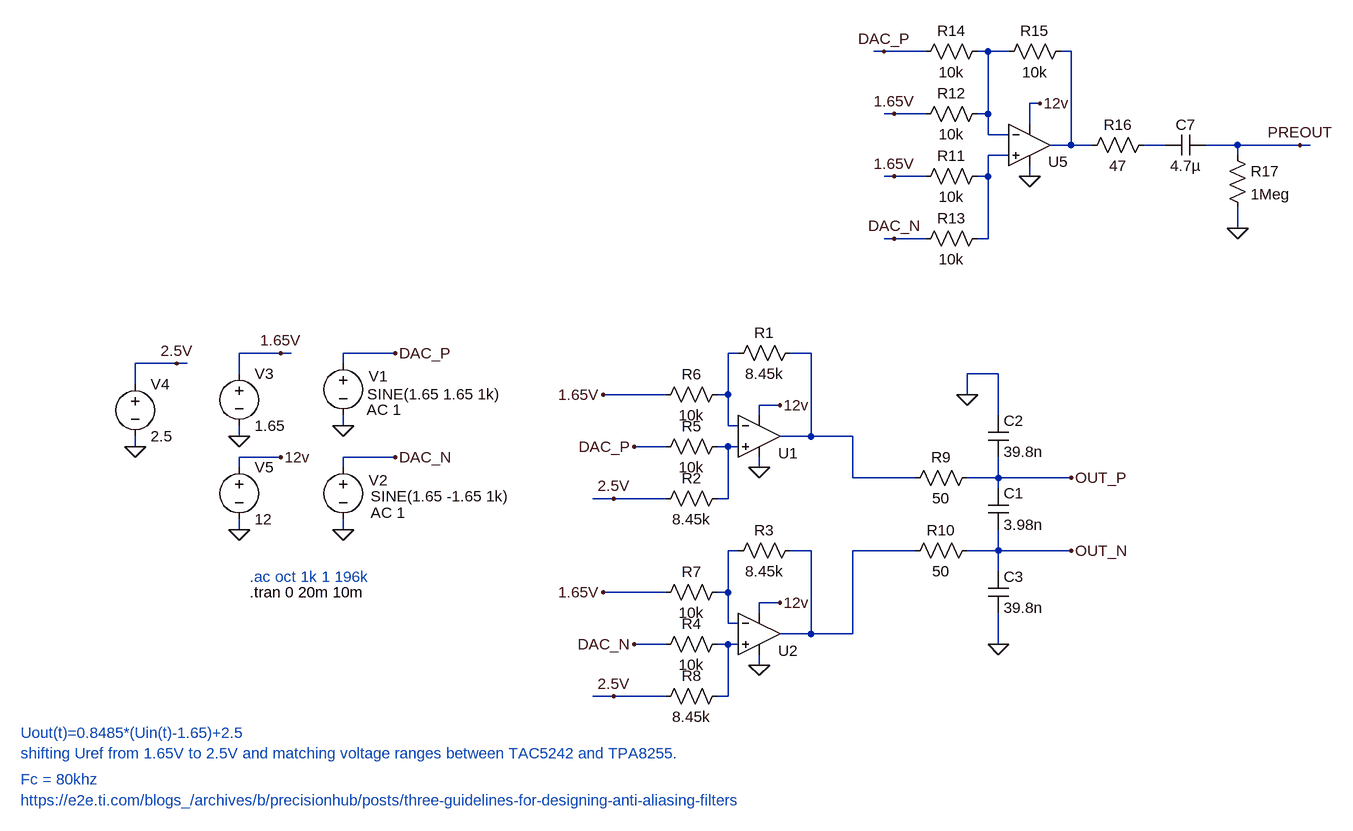
[diagram p0: schematic dac_frontend.asc]
dac_frontend.asc, the LTspice schematic file:
Version 4
SHEET 1 4008 788
WIRE 1824 -1072 1808 -1072
WIRE 1888 -1072 1824 -1072
WIRE 1984 -1072 1968 -1072
WIRE 2016 -1072 1984 -1072
WIRE 2112 -1072 2096 -1072
WIRE 2064 -992 2048 -992
WIRE 1840 -976 1824 -976
WIRE 1888 -976 1840 -976
WIRE 1984 -976 1984 -1072
WIRE 1984 -976 1968 -976
WIRE 2048 -960 2048 -992
WIRE 1984 -944 1984 -976
WIRE 2016 -944 1984 -944
WIRE 2112 -928 2112 -1072
WIRE 2112 -928 2080 -928
WIRE 2144 -928 2112 -928
WIRE 2256 -928 2224 -928
WIRE 2368 -928 2320 -928
WIRE 2464 -928 2368 -928
WIRE 2480 -928 2464 -928
WIRE 2016 -912 1984 -912
WIRE 2368 -912 2368 -928
WIRE 1840 -880 1824 -880
WIRE 1888 -880 1840 -880
WIRE 1984 -880 1984 -912
WIRE 1984 -880 1968 -880
WIRE 2048 -880 2048 -896
WIRE 2368 -800 2368 -832
WIRE 1840 -784 1824 -784
WIRE 1888 -784 1840 -784
WIRE 1984 -784 1984 -880
WIRE 1984 -784 1968 -784
WIRE 896 -608 832 -608
WIRE 912 -608 896 -608
WIRE 1072 -608 992 -608
WIRE 1600 -608 1584 -608
WIRE 1712 -608 1680 -608
WIRE 736 -592 672 -592
WIRE 752 -592 736 -592
WIRE 992 -592 992 -608
WIRE 832 -576 832 -608
WIRE 2000 -576 1952 -576
WIRE 672 -560 672 -592
WIRE 1488 -544 1392 -544
WIRE 1584 -544 1584 -608
WIRE 1584 -544 1568 -544
WIRE 1952 -544 1952 -576
WIRE 1664 -528 1632 -528
WIRE 1632 -512 1632 -528
WIRE 2000 -512 2000 -576
WIRE 992 -496 992 -512
WIRE 1584 -496 1584 -544
WIRE 1600 -496 1584 -496
WIRE 832 -480 832 -496
WIRE 1712 -480 1712 -608
WIRE 1712 -480 1664 -480
WIRE 1776 -480 1712 -480
WIRE 672 -464 672 -480
WIRE 1488 -464 1440 -464
WIRE 1584 -464 1568 -464
WIRE 1600 -464 1584 -464
WIRE 896 -448 832 -448
WIRE 1072 -448 992 -448
WIRE 832 -432 832 -448
WIRE 992 -432 992 -448
WIRE 1632 -432 1632 -448
WIRE 1776 -416 1776 -480
WIRE 1872 -416 1776 -416
WIRE 2000 -416 2000 -448
WIRE 2000 -416 1952 -416
WIRE 2112 -416 2000 -416
WIRE 2000 -400 2000 -416
WIRE 1408 -384 1376 -384
WIRE 1488 -384 1408 -384
WIRE 1584 -384 1584 -464
WIRE 1584 -384 1568 -384
WIRE 832 -336 832 -352
WIRE 992 -336 992 -352
WIRE 1600 -304 1584 -304
WIRE 1712 -304 1680 -304
WIRE 1872 -304 1776 -304
WIRE 2000 -304 2000 -336
WIRE 2000 -304 1952 -304
WIRE 2112 -304 2000 -304
WIRE 2000 -272 2000 -304
WIRE 1488 -240 1392 -240
WIRE 1584 -240 1584 -304
WIRE 1584 -240 1568 -240
WIRE 1664 -224 1632 -224
WIRE 1632 -208 1632 -224
WIRE 1584 -192 1584 -240
WIRE 1600 -192 1584 -192
WIRE 1712 -176 1712 -304
WIRE 1712 -176 1664 -176
WIRE 1776 -176 1776 -304
WIRE 1776 -176 1712 -176
WIRE 1488 -160 1440 -160
WIRE 1584 -160 1568 -160
WIRE 1600 -160 1584 -160
WIRE 2000 -160 2000 -208
WIRE 1632 -128 1632 -144
WIRE 1408 -80 1376 -80
WIRE 1488 -80 1408 -80
WIRE 1584 -80 1584 -160
WIRE 1584 -80 1568 -80
FLAG 1072 -608 DAC_P
FLAG 992 -496 0
FLAG 1072 -448 DAC_N
FLAG 992 -336 0
FLAG 832 -336 0
FLAG 896 -448 12v
FLAG 1664 -528 12v
FLAG 1632 -432 0
FLAG 1440 -464 DAC_P
FLAG 2048 -880 0
FLAG 1824 -1072 DAC_P
FLAG 1840 -784 DAC_N
FLAG 2064 -992 12v
FLAG 832 -480 0
FLAG 896 -608 1.65V
FLAG 1840 -976 1.65V
FLAG 1840 -880 1.65V
FLAG 2464 -928 PREOUT
FLAG 2368 -800 0
FLAG 672 -464 0
FLAG 736 -592 2.5V
FLAG 1392 -544 1.65V
FLAG 1408 -384 2.5V
FLAG 1664 -224 12v
FLAG 1632 -128 0
FLAG 1440 -160 DAC_N
FLAG 1392 -240 1.65V
FLAG 1408 -80 2.5V
FLAG 1952 -544 0
FLAG 2000 -160 0
FLAG 2112 -416 OUT_P
FLAG 2112 -304 OUT_N
SYMBOL voltage 992 -608 R0
WINDOW 0 39 36 Left 2
WINDOW 3 37 63 Left 2
WINDOW 123 36 87 Left 2
WINDOW 39 40 76 Left 2
SYMATTR InstName V1
SYMATTR Value SINE(1.65 1.65 1k)
SYMATTR Value2 AC 1
SYMBOL voltage 992 -448 R0
WINDOW 0 39 36 Left 2
WINDOW 3 42 60 Left 2
WINDOW 123 42 86 Left 2
WINDOW 39 40 76 Left 2
SYMATTR InstName V2
SYMATTR Value SINE(1.65 -1.65 1k)
SYMATTR Value2 AC 1
SYMBOL voltage 832 -448 R0
WINDOW 123 0 0 Left 0
WINDOW 39 24 44 Left 2
SYMATTR InstName V5
SYMATTR Value 12
SYMBOL OpAmps\\UniversalOpAmp 1632 -480 R0
WINDOW 0 29 26 Left 2
SYMATTR InstName U1
SYMBOL OpAmps\\UniversalOpAmp 2048 -928 R0
WINDOW 0 29 26 Left 2
SYMATTR InstName U5
SYMBOL res 1984 -896 R90
WINDOW 0 0 56 VBottom 2
WINDOW 3 32 56 VTop 2
SYMATTR InstName R11
SYMATTR Value 10k
SYMBOL res 1984 -992 R90
WINDOW 0 0 56 VBottom 2
WINDOW 3 32 56 VTop 2
SYMATTR InstName R12
SYMATTR Value 10k
SYMBOL res 1984 -800 R90
WINDOW 0 0 56 VBottom 2
WINDOW 3 32 56 VTop 2
SYMATTR InstName R13
SYMATTR Value 10k
SYMBOL res 1984 -1088 R90
WINDOW 0 0 56 VBottom 2
WINDOW 3 32 56 VTop 2
SYMATTR InstName R14
SYMATTR Value 10k
SYMBOL res 2112 -1088 R90
WINDOW 0 0 56 VBottom 2
WINDOW 3 32 56 VTop 2
SYMATTR InstName R15
SYMATTR Value 10k
SYMBOL voltage 832 -592 R0
WINDOW 123 0 0 Left 0
WINDOW 39 0 0 Left 0
SYMATTR InstName V3
SYMATTR Value 1.65
SYMBOL cap 2320 -944 R90
WINDOW 0 0 32 VBottom 2
WINDOW 3 32 32 VTop 2
SYMATTR InstName C7
SYMATTR Value 4.7µ
SYMBOL res 2240 -944 R90
WINDOW 0 0 56 VBottom 2
WINDOW 3 32 56 VTop 2
SYMATTR InstName R16
SYMATTR Value 47
SYMBOL res 2352 -928 R0
SYMATTR InstName R17
SYMATTR Value 1Meg
SYMBOL voltage 672 -576 R0
WINDOW 123 0 0 Left 0
WINDOW 39 0 0 Left 0
SYMATTR InstName V4
SYMATTR Value 2.5
SYMBOL res 1696 -624 R90
WINDOW 0 0 56 VBottom 2
WINDOW 3 32 56 VTop 2
SYMATTR InstName R1
SYMATTR Value 8.45k
SYMBOL res 1584 -480 R90
WINDOW 0 0 56 VBottom 2
WINDOW 3 32 56 VTop 2
SYMATTR InstName R5
SYMATTR Value 10k
SYMBOL res 1584 -560 R90
WINDOW 0 0 56 VBottom 2
WINDOW 3 32 56 VTop 2
SYMATTR InstName R6
SYMATTR Value 10k
SYMBOL res 1584 -400 R90
WINDOW 0 0 56 VBottom 2
WINDOW 3 32 56 VTop 2
SYMATTR InstName R2
SYMATTR Value 8.45k
SYMBOL OpAmps\\UniversalOpAmp 1632 -176 R0
WINDOW 0 29 26 Left 2
SYMATTR InstName U2
SYMBOL res 1696 -320 R90
WINDOW 0 0 56 VBottom 2
WINDOW 3 32 56 VTop 2
SYMATTR InstName R3
SYMATTR Value 8.45k
SYMBOL res 1584 -176 R90
WINDOW 0 0 56 VBottom 2
WINDOW 3 32 56 VTop 2
SYMATTR InstName R4
SYMATTR Value 10k
SYMBOL res 1584 -256 R90
WINDOW 0 0 56 VBottom 2
WINDOW 3 32 56 VTop 2
SYMATTR InstName R7
SYMATTR Value 10k
SYMBOL res 1584 -96 R90
WINDOW 0 0 56 VBottom 2
WINDOW 3 32 56 VTop 2
SYMATTR InstName R8
SYMATTR Value 8.45k
SYMBOL res 1968 -432 R90
WINDOW 0 0 56 VBottom 2
WINDOW 3 32 56 VTop 2
SYMATTR InstName R9
SYMATTR Value 50
SYMBOL res 1968 -320 R90
WINDOW 0 0 56 VBottom 2
WINDOW 3 32 56 VTop 2
SYMATTR InstName R10
SYMATTR Value 50
SYMBOL cap 1984 -400 R0
SYMATTR InstName C1
SYMATTR Value 3.98n
SYMBOL cap 1984 -512 R0
SYMATTR InstName C2
SYMATTR Value 39.8n
SYMBOL cap 1984 -272 R0
SYMATTR InstName C3
SYMATTR Value 39.8n
TEXT 848 -264 Left 2 ;.ac oct 1k 1 196k
TEXT 848 -240 Left 2 !.tran 0 20m 10m
TEXT 496 -24 Left 2 ;Uout(t)=0.8485*(Uin(t)-1.65)+2.5
TEXT 496 8 Left 2 ;shifting Uref from 1.65V to 2.5V and matching voltage ranges between TAC5242 and TPA8255.
TEXT 496 48 Left 2 ;Fc = 80khz
TEXT 496 80 Left 2 ;https://e2e.ti.com/blogs_/archives/b/precisionhub/posts/three-guidelines-for-designing-anti-aliasing-filters

The netlist it stands for:
* dac_frontend.asc
V1 DAC_P 0 SINE(1.65 1.65 1k) AC 1
V2 DAC_N 0 SINE(1.65 -1.65 1k) AC 1
V5 12v 0 12
XU1 N007 N005 12v 0 N006 level1 Avol=1Meg GBW=10Meg Vos=0 En=0 Enk=0 In=0 Ink=0 Rin=500Meg  ; pins In+ In- V+ V- OUT
XU5 N004 N001 12v 0 N002 level1 Avol=1Meg GBW=10Meg Vos=0 En=0 Enk=0 In=0 Ink=0 Rin=500Meg  ; pins In+ In- V+ V- OUT
R11 N004 1.65V 10k
R12 N001 1.65V 10k
R13 N004 DAC_N 10k
R14 N001 DAC_P 10k
R15 N002 N001 10k
V3 1.65V 0 1.65
C7 PREOUT N003 4.7µ
R16 N003 N002 47
R17 PREOUT 0 1Meg
V4 2.5V 0 2.5
R1 N006 N005 8.45k
R5 N007 DAC_P 10k
R6 N005 1.65V 10k
R2 N007 2.5V 8.45k
XU2 N010 N008 12v 0 N009 level1 Avol=1Meg GBW=10Meg Vos=0 En=0 Enk=0 In=0 Ink=0 Rin=500Meg  ; pins In+ In- V+ V- OUT
R3 N009 N008 8.45k
R4 N010 DAC_N 10k
R7 N008 1.65V 10k
R8 N010 2.5V 8.45k
R9 OUT_P N006 50
R10 OUT_N N009 50
C1 OUT_P OUT_N 3.98n
C2 0 OUT_P 39.8n
C3 OUT_N 0 39.8n
* .ac oct 1k 1 196k
.tran 0 20m 10m
* Uout(t)=0.8485*(Uin(t)-1.65)+2.5
* shifting Uref from 1.65V to 2.5V and matching voltage ranges between TAC5242 and TPA8255.
* Fc = 80khz
* https://e2e.ti.com/blogs_/archives/b/precisionhub/posts/three-guidelines-for-designing-anti-aliasing-filters
.lib UniversalOpAmp1.lib
.backanno
.end